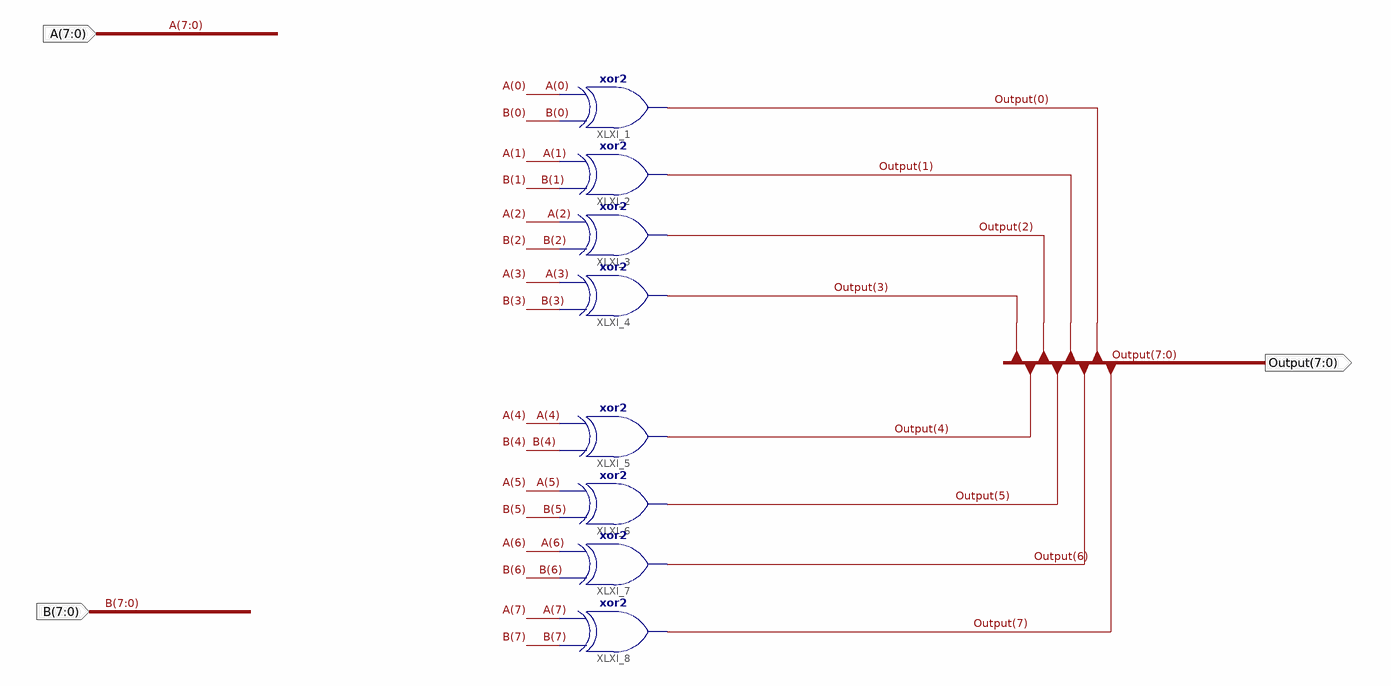
[diagram p0: schematic sheet 1]
// Xilinx ISE schematic proj1xor8to8.sch (spartan6) as structural Verilog: 8 symbols, 3 ports
module proj1xor8to8 (
  input  [7:0] B,
  input  [7:0] A,
  output [7:0] Output
);

  xor XLXI_1 (Output[0], B[0], A[0]);
  xor XLXI_2 (Output[1], B[1], A[1]);
  xor XLXI_3 (Output[2], B[2], A[2]);
  xor XLXI_4 (Output[3], B[3], A[3]);
  xor XLXI_5 (Output[4], B[4], A[4]);
  xor XLXI_6 (Output[5], B[5], A[5]);
  xor XLXI_7 (Output[6], B[6], A[6]);
  xor XLXI_8 (Output[7], B[7], A[7]);
endmodule
